# EasyEDA Pro project esp32_clock.eprj

# Schematic main
Create Date: 2022-02-27; Page Name: P1; Project Name: esp32_clock; Schematic Name: main; Update Date: 2022-08-12; Add into BOM: yes; Company: 深圳嘉立创科技发展有限公司; Convert to PCB: yes; Drawed: 嘉立创EDA; Page Size: A3; Part Number: JLCPCB-001; Reviewed: 嘉立创EDA; Version: V0.1
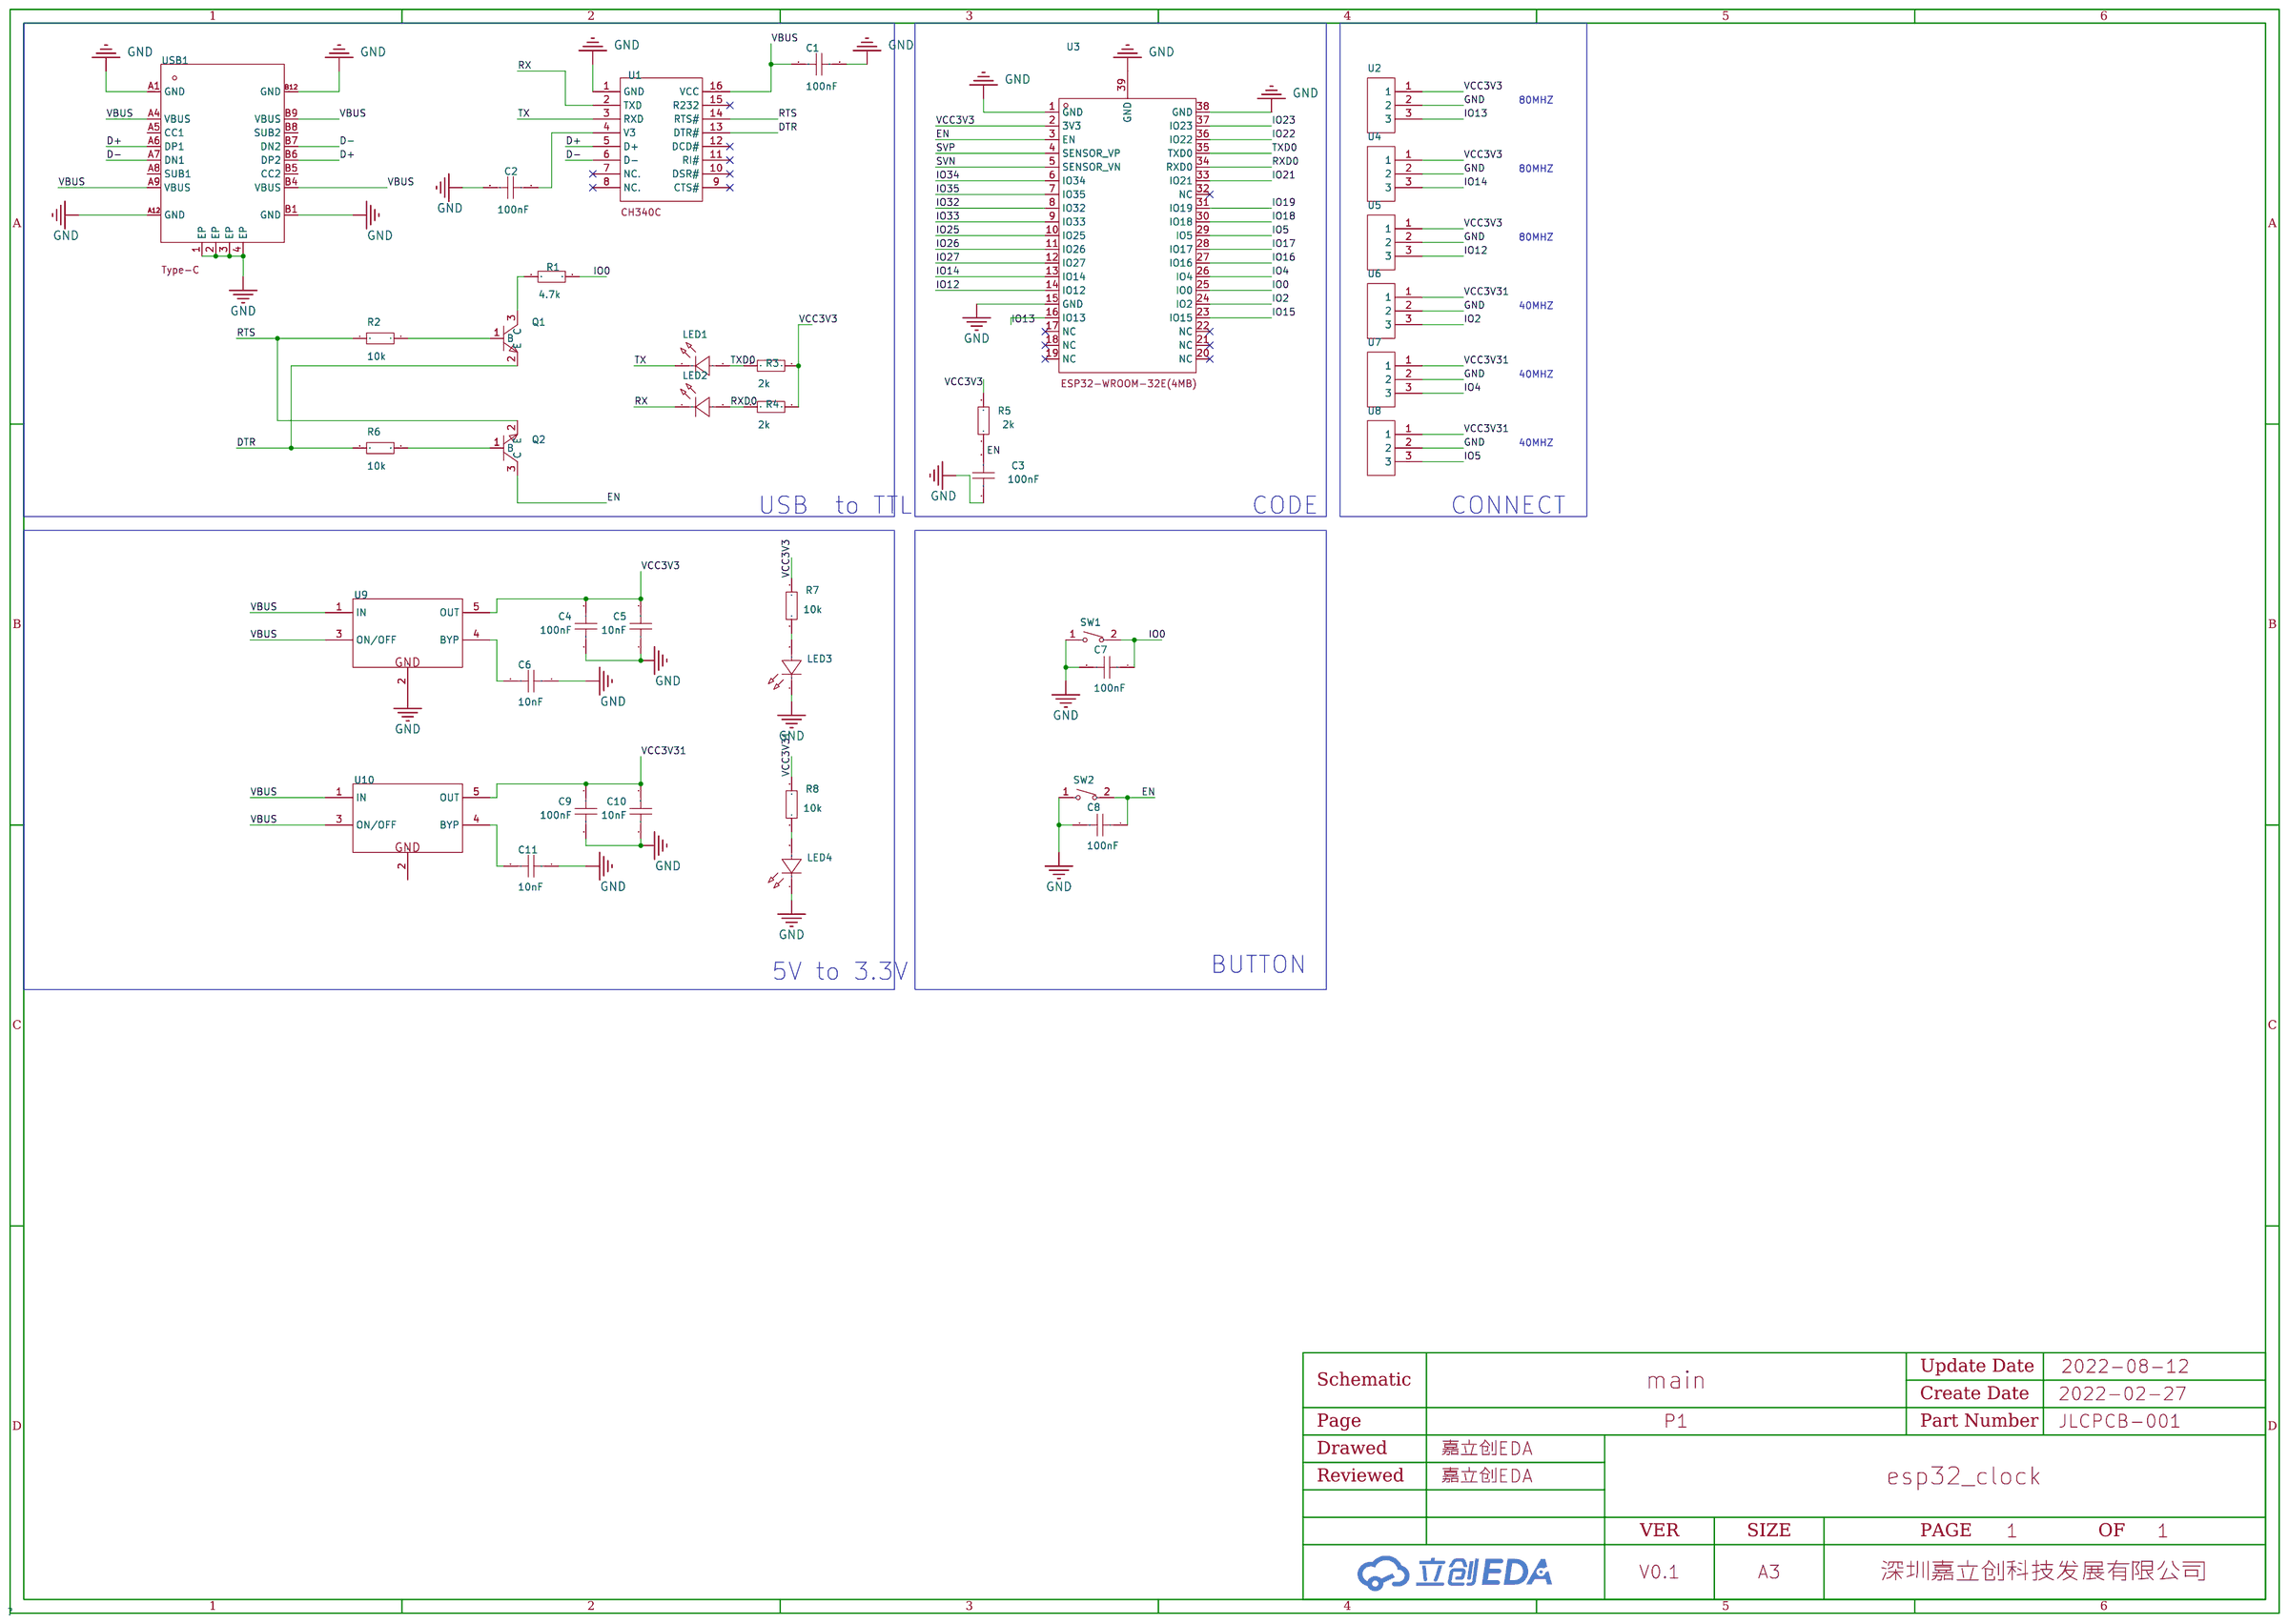
[diagram p0: schematic sheet]

## Parts
C1  100nF  [c0603]
C2  100nF  [c0603]
C3  100nF  [c0603]
C4  100nF  [c0603]
C5  10nF  [c0603]
C6  10nF  [c0603]
C7  100nF  [c0603]
C8  100nF  [c0603]
C9  100nF  [c0603]
C10  10nF  [c0603]
C11  10nF  [c0603]
LED1  11-21/BHC-AQ2S2/2T  [led-smd_l3.0-w1.5-rd]
LED2  11-21/BHC-AQ2S2/2T  [led-smd_l3.0-w1.5-rd]
LED3  11-21/BHC-AQ2S2/2T  [led-smd_l3.0-w1.5-rd]
LED4  11-21/BHC-AQ2S2/2T  [led-smd_l3.0-w1.5-rd]
Q1  -  [sot-23-3_l2.9-w1.3-p1.90-ls2.4-br]
Q2  -  [sot-23-3_l2.9-w1.3-p1.90-ls2.4-br]
R1  4.7k  [r0603]
R2  10k  [r0603]
R3  2k  [r0603]
R4  2k  [r0603]
R5  2k  [r0603]
R6  10k  [r0603]
R7  10k  [r0603]
R8  10k  [r0603]
SW1  -  [sw-smd_l6.0-w3.5-ls8.0-eh-1]
SW2  -  [sw-smd_l6.0-w3.5-ls8.0-eh-1]
U1  -  [sop-16_l10.0-w3.9-p1.27-ls6.0-bl]
U2  -  [conn-th_3p-p2.50_b3b-xh-a-lf-sn]
U3  U1  [wifi-smd_esp32-wroom-32e]
U4  -  [conn-th_3p-p2.50_b3b-xh-a-lf-sn]
U5  -  [conn-th_3p-p2.50_b3b-xh-a-lf-sn]
U6  -  [conn-th_3p-p2.50_b3b-xh-a-lf-sn]
U7  -  [conn-th_3p-p2.50_b3b-xh-a-lf-sn]
U8  -  [conn-th_3p-p2.50_b3b-xh-a-lf-sn]
U9  -  [sot-23-5_l3.0-w1.7-p0.95-ls2.8-br]
U10  -  [sot-23-5_l3.0-w1.7-p0.95-ls2.8-br]
USB1  -  [usb-c-smd_kh-type-c-16p]

## Library data of the parts
C1 C2 = 0603F104Z500CT: 容值:100nF;精度:-20%~+80%;额定电压:50V;材质(温度系数):Y5V;; LCSC Part Name: 100nF -20%~+80% 50V; Supplier Part: C83060; Manufacturer: Walsin(华新科); Supplier Footprint: 0603; Datasheet: https://atta.szlcsc.com/upload/public/pdf/source/20161119/1479540179445.pdf; Supplier: LCSC; Tolerance: -20%~+80%; Voltage Rated: 50V; Temperature Coefficient: Y5V; JLCPCB Part Class: Extended Part
C3 C7 C8 = CL10B104KC8NNNC: 容值:100nF;精度:±10%;额定电压:100V;材质(温度系数):X7R;; LCSC Part Name: 100nF ±10% 100V; Supplier Part: C15725; Manufacturer: SAMSUNG(三星); Supplier Footprint: 0603; Datasheet: https://atta.szlcsc.com/upload/public/pdf/source/20160103/1457707678663.pdf; Supplier: LCSC; Tolerance: ±10%; Voltage Rated: 100V; Temperature Coefficient: X7R
C4-C6 C9-C11 = CC0603KRX7R9BB104: 容值:100nF;精度:±10%;额定电压:50V;材质(温度系数):X7R;; LCSC Part Name: 100nF ±10% 50V; Supplier Part: C14663; Manufacturer: YAGEO(国巨); Supplier Footprint: 0603; Datasheet: https://atta.szlcsc.com/upload/public/pdf/source/20170116/1484561234239.pdf; Supplier: LCSC; Tolerance: ±10%; Voltage Rated: 50V; Temperature Coefficient: X7R
LED1-LED4 = 11-21/BHC-AQ2S2/2T: LCSC Part Name: Led; Supplier Part: C3014404; Manufacturer: EVERLIGHT(台湾亿光); Supplier Footprint: SMD,1.5x3mm; Datasheet: https://atta.szlcsc.com/upload/public/pdf/source/20220513/A56B845CA083C4E68F88D304929CC0C5.pdf; Supplier: LCSC
Q1 Q2 = S8050LT1 J3Y: LCSC Part Name: S8050; Supplier Part: C2926165; Manufacturer: FOSAN(富信); Manufacturer Part: S8050 J3Y; Supplier Footprint: SOT-23; Datasheet: https://atta.szlcsc.com/upload/public/pdf/source/20211203/FAF9E446EEEFA352739C30D23AB52B1B.pdf; Supplier: LCSC; JLCPCB Part Class: Extended Part
R1 R3-R5 = RC0805JR-072KL: 电阻类型:厚膜电阻;阻值:2k;精度:±5%;功率:125mW;温度系数:±100ppm/;最大工作电压:150V;工作温度范围:-55~+155;; LCSC Part Name: 2k ±5%; Supplier Part: C114748; Manufacturer: YAGEO(国巨); Supplier Footprint: 0805; Datasheet: https://atta.szlcsc.com/upload/public/pdf/source/20170704/1499151299173.pdf; Supplier: LCSC; Type: 厚膜电阻; Tolerance: ±5%; Power(Watts): 125mW; Temperature Coefficient: ±100ppm/; Overload Voltage (Max): 150V; Operating Temperature Range: -55~+155
R2 R6 = RS-03K1202FT: 阻值:12k;精度:±1%;功率:100mW;温度系数:±100ppm/;最大工作电压:50V;工作温度范围:-55~+155;; LCSC Part Name: 12k ±1%; Supplier Part: C136587; Manufacturer: FH(风华); Supplier Footprint: 0603; Datasheet: https://atta.szlcsc.com/upload/public/pdf/source/20181015/C136587_D0866CBA43F0FA75C317B7AA905D85E4.pdf; Supplier: LCSC; Tolerance: ±1%; Power(Watts): 100mW; Temperature Coefficient: ±100ppm/; Overload Voltage (Max): 50V; Operating Temperature Range: -55~+155; JLCPCB Part Class: Extended Part
R7 R8 = 0805W8J0103T5E: 电阻类型:厚膜电阻;阻值:10k;精度:±5%;功率:125mW;温度系数:±100ppm/;最大工作电压:150V;工作温度范围:-55~+155;; LCSC Part Name: 10k ±5%; Supplier Part: C25612; Manufacturer: UNI-ROYAL(厚声); Supplier Footprint: 0805; Datasheet: https://atta.szlcsc.com/upload/public/pdf/source/20200306/C422600_1E6D84923E4A46A82E41ADD87F860B5C.pdf; Supplier: LCSC; Type: 厚膜电阻; Tolerance: ±5%; Power(Watts): 125mW; Temperature Coefficient: ±100ppm/; Overload Voltage (Max): 150V; Operating Temperature Range: -55~+155
SW1 SW2 = TS-KG01T-ART50F: 触点电流:50mA;额定电压(DC):12V;绝缘电阻:100M;电路结构:单刀单掷;安装方式:立贴;按钮形状:矩形按钮;按钮/盖帽颜色:白色;作用力:250gf@±50gf;引脚样式:鸥翼型;开关长度:6mm;开关宽度:3.5mm;开关高度:5mm;带支架:否;; LCSC Part Name: 3*6*5.0正按贴片式按键开关 轻触开关; Supplier Part: C2874263; Manufacturer: HANBO(汉博); Supplier Footprint: SMD; Datasheet: https://atta.szlcsc.com/upload/public/pdf/source/20210827/D384EB065BE60C1A2BD0AE232663F41A.pdf; Supplier: LCSC; Contact Current: 50mA; Voltage Rating (DC): 12V; Insulation Resistance: 100M; Circuit: 单刀单掷; Mounting Style: 立贴; Actuator Style: 矩形按钮; Actuator/Cap Color: 白色; Operating Force: 250gf@±50gf; Pin Style: 鸥翼型; Switch Length: 6mm; Switch Width: 3.5mm; Switch Height: 5mm; Strike Gundam: 否
U1 = CH340C: 类型:Transceiver;协议类别:USB 2.0;驱动器/接收器数:-;数据速率:2Mbps;; Supplier Part: C84681; Manufacturer: WCH(南京沁恒); Supplier Footprint: SOP-16_150mil; Datasheet: https://atta.szlcsc.com/upload/public/pdf/source/20200819/C84681_ADBED554CE321879DBD6B1D06488689C.pdf; Supplier: LCSC; Type: Transceiver; Protocol: USB 2.0; Data Rate: 2Mbps; Supply Voltage: 3.3V, 5V; JLCPCB Part Class: Extended Part
U2 U4-U8 = B3B-XH-A(LF)(SN): 参考系列:XH;间距:2.5mm;插针结构:1x3P;排数:1;每排PIN数:3;行距:-;安装方式:-;触头材质:黄铜;; LCSC Part Name: XH插座 1*3P 间距2.5mm 直针; Supplier Part: C144394; Manufacturer: JST; Supplier Footprint: 插件,P=2.5mm; Datasheet: https://atta.szlcsc.com/upload/public/pdf/source/20180327/C144394_40EBA2F68C817AED706C9EFF4B81600D.pdf; Supplier: LCSC; Reference Series: XH; Pitch: 2.5mm; Pins Structure: 1x3P; Number of Rows: 1; Number of PINs Per Row: 3; Contact Material: 黄铜
U3 = ESP32-WROOM-32E(4MB): ESP32-WROOM-32E 集成 ESP32-D0WD-V3 芯片，具有?高的稳定性和安全性能。; LCSC Part Name: WIFI模块 PCB板载天线模组; Supplier Part: C701341; Manufacturer: ESPRESSIF(乐鑫); Supplier Footprint: SMD38,18x25.5x3.1; Datasheet: https://atta.szlcsc.com/upload/public/pdf/source/20200730/C701341_95E089979D39CD8D2471FDC7C7AF29A1.pdf; Supplier: LCSC; JLCPCB Part Class: Extended Part
U9 U10 = LP2992IM5-3.3/NOPB: 输出类型:固定;输出极性:正;输出通道数:1;最大输入电压:16V;输出电压:3.3V;压差:850mV@(250mA);输出电流:250mA;电源纹波抑制比(PRSS):45dB@(1kHz);; LCSC Part Name: Vin=16V Vout=3.3V 250mA 45dB@(1kHz); Supplier Part: C129353; Manufacturer: TI(德州仪器); Supplier Footprint: SOT-23-5; Datasheet: https://atta.szlcsc.com/upload/public/pdf/source/20170914/C129353_1505359994993968193.pdf; Supplier: LCSC; Output Type: 固定; Output Polarity: 正; Number of Outputs: 1; Maximum Input Voltage: 16V; Output Voltage: 3.3V; Dropout Voltage: 850mV@(250mA); Output Current: 250mA; Power Supply Rejection Ratio (PRSS): 45dB@(1kHz); JLCPCB Part Class: Extended Part
USB1 = KH-TYPE-C-16P: 连接器类型:Type-C;标准:-;公母:母座;触点数量:16;端口数量:1;安装方式:卧贴;额定电流 - 电源:3A;工作温度范围:-40~+85;; LCSC Part Name: Type-C 母座 卧贴; Supplier Part: C709357; Manufacturer: kinghelm(金航标); Supplier Footprint: SMD; Datasheet: https://atta.szlcsc.com/upload/public/pdf/source/20200911/C709357_AA8DCEB38BB20E3035A7ED7AE7667837.pdf; Supplier: LCSC; Connector Type: Type-C; Gender: 母座; Number of Contacts: 16; Number of Ports: 1; Mounting Style: 卧贴; Current Rating - Power (Max): 3A; Operating Temperature Range: -40~+85; JLCPCB Part Class: Extended Part

## Nets
GND: C1.2 C2.1 C3.1 C4.1 C5.1 C6.1 C7.2 C8.2 C9.1 C10.1 C11.1 LED3.1(K) LED4.1(K) SW1.1 SW2.1 U1.1(GND) U2.2 U3.1(GND) U3.15(GND) U3.38(GND) U3.39(GND) U4.2 U5.2 U6.2 U7.2 U8.2 U9.2(GND) U10.2(GND) USB1.1(EP) USB1.2(EP) USB1.3(EP) USB1.4(EP) USB1.A1(GND) USB1.A12(GND) USB1.B1(GND) USB1.B12(GND)
VBUS: C1.1 U1.16(VCC) U9.1(IN) U9.3(ON/OFF) U10.1(IN) U10.3(ON/OFF) USB1.A4(VBUS) USB1.A9(VBUS) USB1.B4(VBUS) USB1.B9(VBUS)
VCC3V3: C4.2 C5.2 R3.2 R4.2 R5.2 R7.2 U2.1 U3.2(3V3) U4.1 U5.1 U9.5(OUT)
VCC3V31: C9.2 C10.2 R8.2 U6.1 U7.1 U8.1 U10.5(OUT)
D+: U1.5(D+) USB1.A6(DP1) USB1.B6(DP2)
D-: U1.6(D-) USB1.A7(DN1) USB1.B7(DN2)
DTR: Q1.2(E) R6.1 U1.13(DTR#)
EN: C3.2 C8.1 Q2.3(C) R5.1 SW2.2 U3.3(EN)
IO0: C7.1 R1.2 SW1.2 U3.25(IO0)
IO2: U3.24(IO2) U6.3
IO4: U3.26(IO4) U7.3
IO5: U3.29(IO5) U8.3
IO12: U3.14(IO12) U5.3
IO13: U2.3 U3.16(IO13)
IO14: U3.13(IO14) U4.3
IO15: U3.23(IO15)
IO16: U3.27(IO16)
IO17: U3.28(IO17)
IO18: U3.30(IO18)
IO19: U3.31(IO19)
IO21: U3.33(IO21)
IO22: U3.36(IO22)
IO23: U3.37(IO23)
IO25: U3.10(IO25)
IO26: U3.11(IO26)
IO27: U3.12(IO27)
IO32: U3.8(IO32)
IO33: U3.9(IO33)
IO34: U3.6(IO34)
IO35: U3.7(IO35)
RTS: Q2.2(E) R2.1 U1.14(RTS#)
RX: LED2.1(K) U1.2(TXD)
RXD0: LED2.2(A) R4.1 U3.34(RXD0)
SVN: U3.5(SENSOR_VN)
SVP: U3.4(SENSOR_VP)
TX: LED1.1(K) U1.3(RXD)
TXD0: LED1.2(A) R3.1 U3.35(TXD0)
$1N2597: C2.2 U1.4(V3)
$1N6917: C6.2 U9.4(BYP)
$1N7926: Q2.1(B) R6.2
$1N7936: Q1.1(B) R2.2
$1N10272: LED3.2(A) R7.1
$1N11018: Q1.3(C) R1.1
$1N18113: C11.2 U10.4(BYP)
$1N18730: LED4.2(A) R8.1

Not connected (* = marked no-connect by the designer): U1 7(NC.)* 8(NC.)* 9(CTS#)* 10(DSR#)* 11(RI#)* 12(DCD#)* 15(R232)*; U3 17(NC)* 18(NC)* 19(NC)* 20(NC)* 21(NC)* 22(NC)* 32(NC)*; USB1 A5(CC1) A8(SUB1) B5(CC2) B8(SUB2)

## Notes on the sheet
- 80MHZ
- 80MHZ
- 80MHZ
- 40MHZ
- 40MHZ
- 40MHZ
- USB  to TTL
- CODE
- CONNECT
- 5V to 3.3V
- BUTTON

# Schematic light
Create Date: 2022-08-10; Page Name: P1; Project Name: esp32_clock; Schematic Name: light; Update Date: 2022-08-10
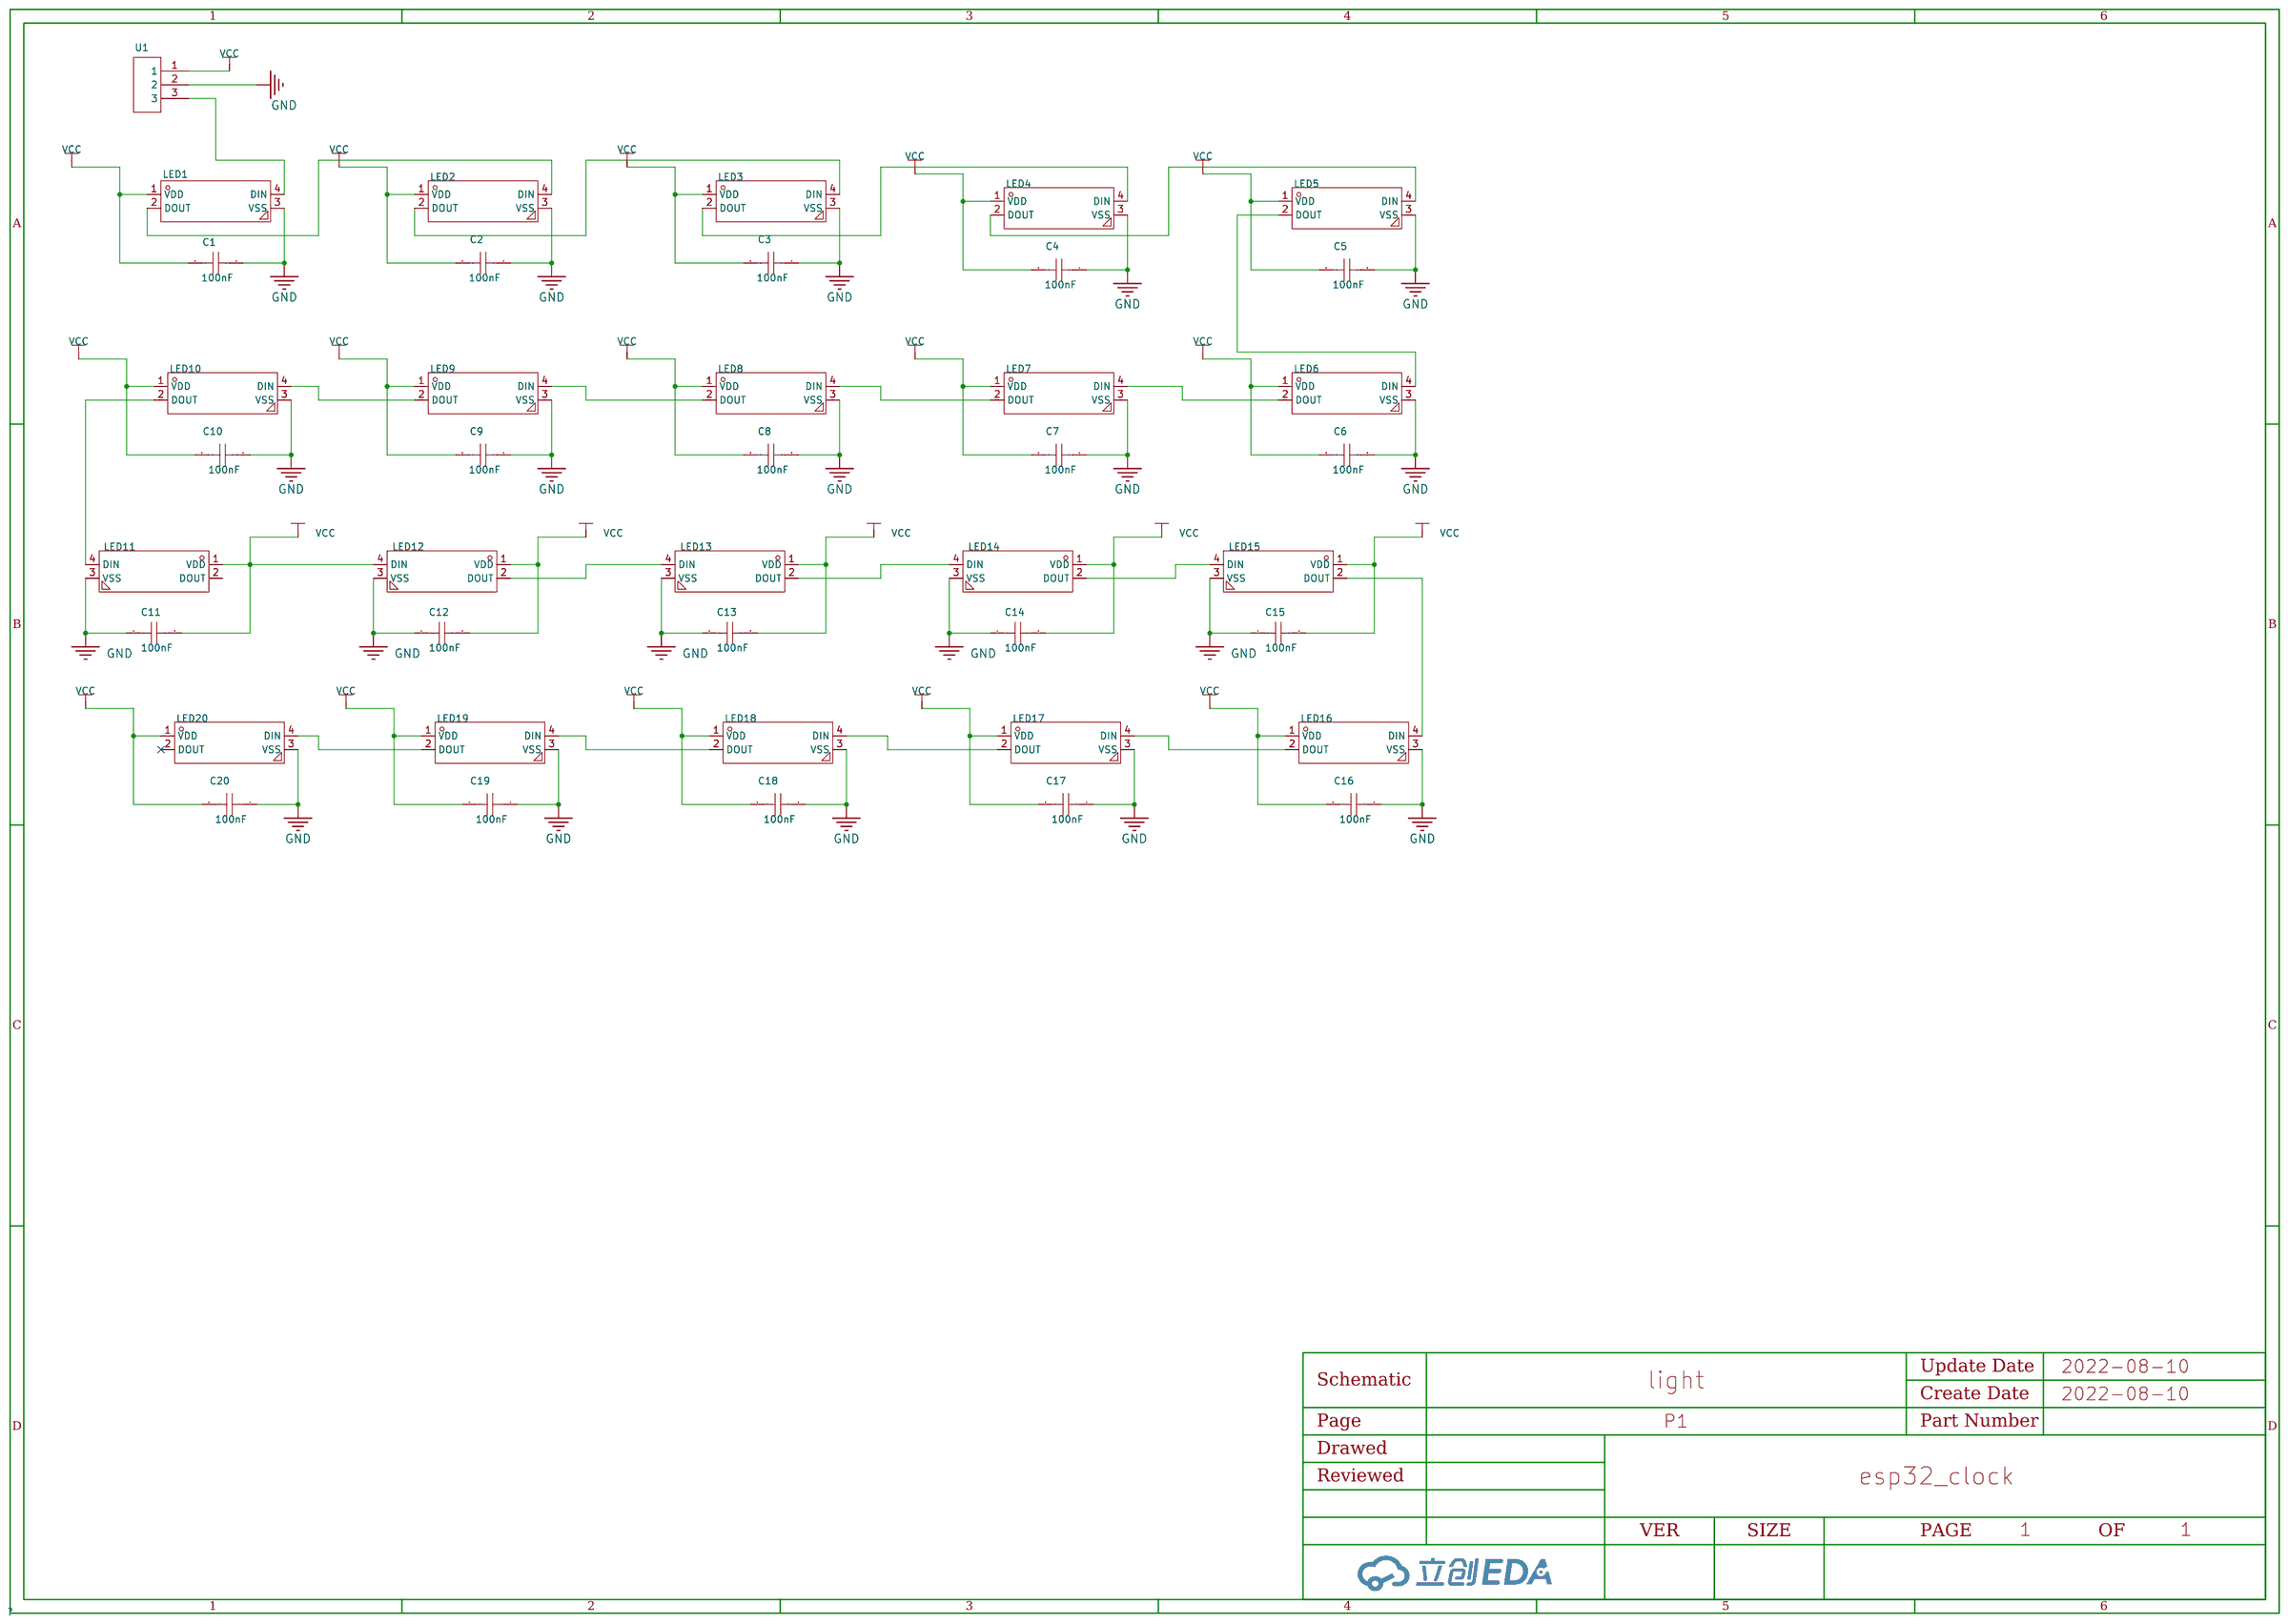
[diagram p1: schematic sheet]

## Parts
C1  100nF  [c0603]
C2  100nF  [c0603]
C3  100nF  [c0603]
C4  100nF  [c0603]
C5  100nF  [c0603]
C6  100nF  [c0603]
C7  100nF  [c0603]
C8  100nF  [c0603]
C9  100nF  [c0603]
C10  100nF  [c0603]
C11  100nF  [c0603]
C12  100nF  [c0603]
C13  100nF  [c0603]
C14  100nF  [c0603]
C15  100nF  [c0603]
C16  100nF  [c0603]
C17  100nF  [c0603]
C18  100nF  [c0603]
C19  100nF  [c0603]
C20  100nF  [c0603]
LED1  WS2812B-B  [led-smd_4p-l5.0-w5.0-tl_ws2812b-b]
LED2  WS2812B-B  [led-smd_4p-l5.0-w5.0-tl_ws2812b-b]
LED3  WS2812B-B  [led-smd_4p-l5.0-w5.0-tl_ws2812b-b]
LED4  WS2812B-B  [led-smd_4p-l5.0-w5.0-tl_ws2812b-b]
LED5  WS2812B-B  [led-smd_4p-l5.0-w5.0-tl_ws2812b-b]
LED6  WS2812B-B  [led-smd_4p-l5.0-w5.0-tl_ws2812b-b]
LED7  WS2812B-B  [led-smd_4p-l5.0-w5.0-tl_ws2812b-b]
LED8  WS2812B-B  [led-smd_4p-l5.0-w5.0-tl_ws2812b-b]
LED9  WS2812B-B  [led-smd_4p-l5.0-w5.0-tl_ws2812b-b]
LED10  WS2812B-B  [led-smd_4p-l5.0-w5.0-tl_ws2812b-b]
LED11  WS2812B-B  [led-smd_4p-l5.0-w5.0-tl_ws2812b-b]
LED12  WS2812B-B  [led-smd_4p-l5.0-w5.0-tl_ws2812b-b]
LED13  WS2812B-B  [led-smd_4p-l5.0-w5.0-tl_ws2812b-b]
LED14  WS2812B-B  [led-smd_4p-l5.0-w5.0-tl_ws2812b-b]
LED15  WS2812B-B  [led-smd_4p-l5.0-w5.0-tl_ws2812b-b]
LED16  WS2812B-B  [led-smd_4p-l5.0-w5.0-tl_ws2812b-b]
LED17  WS2812B-B  [led-smd_4p-l5.0-w5.0-tl_ws2812b-b]
LED18  WS2812B-B  [led-smd_4p-l5.0-w5.0-tl_ws2812b-b]
LED19  WS2812B-B  [led-smd_4p-l5.0-w5.0-tl_ws2812b-b]
LED20  WS2812B-B  [led-smd_4p-l5.0-w5.0-tl_ws2812b-b]
U1  -  [conn-th_3p-p2.50_b3b-xh-a-lf-sn]

## Library data of the parts
C1-C20 = TCC0603X7R104K500CT: 容值:100nF;精度:±10%;额定电压:50V;材质(温度系数):X7R;; LCSC Part Name: 100nF ±10% 50V; Supplier Part: C282519; Manufacturer: CCTC(三环); Supplier Footprint: 0603; Datasheet: https://atta.szlcsc.com/upload/public/pdf/source/20180917/C282519_8CE721FA29EE85BB321020B63D7877A0.pdf; Supplier: LCSC; Tolerance: ±10%; Voltage Rated: 50V; Temperature Coefficient: X7R
LED1-LED20 = WS2812B-B: 发光颜色:RGB三色;; LCSC Part Name: RGB三色 （注意防潮，请查阅规格书中对应具体内容）; Supplier Part: C114586; Manufacturer: worldsemi; Supplier Footprint: 5050(mm); Datasheet: https://atta.szlcsc.com/upload/public/pdf/source/20200615/C114586_26EB6813EC9F2A3F6C7FBB2AD75DE01F.pdf; Supplier: LCSC; Emitted Color: RGB三色
U1 = B3B-XH-A(LF)(SN): 参考系列:XH;间距:2.5mm;插针结构:1x3P;排数:1;每排PIN数:3;行距:-;安装方式:-;触头材质:黄铜;; LCSC Part Name: XH插座 1*3P 间距2.5mm 直针; Supplier Part: C144394; Manufacturer: JST; Supplier Footprint: 插件,P=2.5mm; Datasheet: https://atta.szlcsc.com/upload/public/pdf/source/20180327/C144394_40EBA2F68C817AED706C9EFF4B81600D.pdf; Supplier: LCSC; Reference Series: XH; Pitch: 2.5mm; Pins Structure: 1x3P; Number of Rows: 1; Number of PINs Per Row: 3; Contact Material: 黄铜

## Nets
GND: C1.1 C2.1 C3.1 C4.1 C5.1 C6.1 C7.1 C8.1 C9.1 C10.1 C11.1 C12.1 C13.1 C14.1 C15.1 C16.1 C17.1 C18.1 C19.1 C20.1 LED1.3(VSS) LED2.3(VSS) LED3.3(VSS) LED4.3(VSS) LED5.3(VSS) LED6.3(VSS) LED7.3(VSS) LED8.3(VSS) LED9.3(VSS) LED10.3(VSS) LED11.3(VSS) LED12.3(VSS) LED13.3(VSS) LED14.3(VSS) LED15.3(VSS) LED16.3(VSS) LED17.3(VSS) LED18.3(VSS) LED19.3(VSS) LED20.3(VSS) U1.2
VCC: C1.2 C2.2 C3.2 C4.2 C5.2 C6.2 C7.2 C8.2 C9.2 C10.2 C11.2 C12.2 C13.2 C14.2 C15.2 C16.2 C17.2 C18.2 C19.2 C20.2 LED1.1(VDD) LED2.1(VDD) LED3.1(VDD) LED4.1(VDD) LED5.1(VDD) LED6.1(VDD) LED7.1(VDD) LED8.1(VDD) LED9.1(VDD) LED10.1(VDD) LED11.1(VDD) LED12.1(VDD) LED12.4(DIN) LED13.1(VDD) LED14.1(VDD) LED15.1(VDD) LED16.1(VDD) LED17.1(VDD) LED18.1(VDD) LED19.1(VDD) LED20.1(VDD) U1.1
$1N4630: LED1.4(DIN) U1.3
$1N4980: LED1.2(DOUT) LED2.4(DIN)
$1N5294: LED2.2(DOUT) LED3.4(DIN)
$1N5614: LED3.2(DOUT) LED4.4(DIN)
$1N5940: LED4.2(DOUT) LED5.4(DIN)
$1N6272: LED5.2(DOUT) LED6.4(DIN)
$1N6610: LED6.2(DOUT) LED7.4(DIN)
$1N10070: LED10.2(DOUT) LED11.4(DIN)
$1N10076: LED12.2(DOUT) LED13.4(DIN)
$1N11666: LED15.2(DOUT) LED16.4(DIN)
$1N11672: LED17.2(DOUT) LED18.4(DIN)
$1N11675: LED18.2(DOUT) LED19.4(DIN)
$1N13346: LED7.2(DOUT) LED8.4(DIN)
$1N13393: LED8.2(DOUT) LED9.4(DIN)
$1N13814: LED9.2(DOUT) LED10.4(DIN)
$1N14639: LED13.2(DOUT) LED14.4(DIN)
$1N14851: LED14.2(DOUT) LED15.4(DIN)
$1N15317: LED16.2(DOUT) LED17.4(DIN)
$1N16131: LED19.2(DOUT) LED20.4(DIN)

Not connected (* = marked no-connect by the designer): LED11 2(DOUT); LED20 2(DOUT)*

# Board PCB2
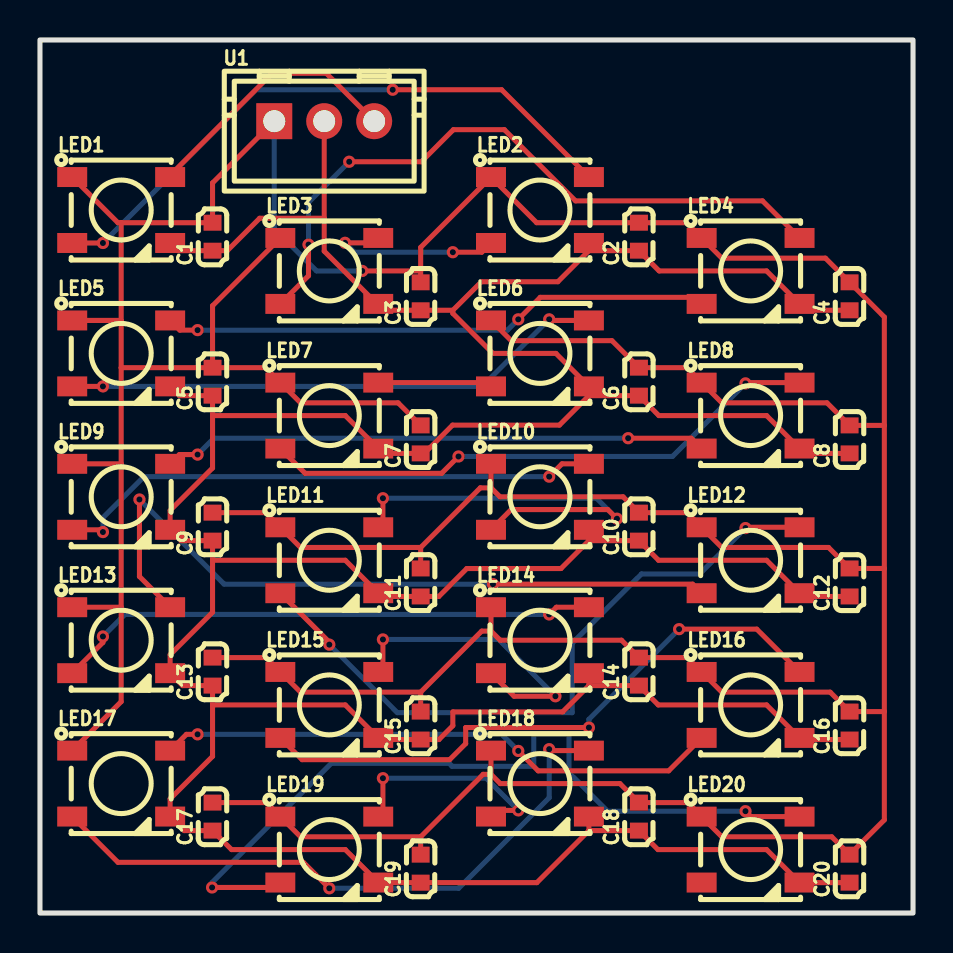
[diagram p2: board, top side]
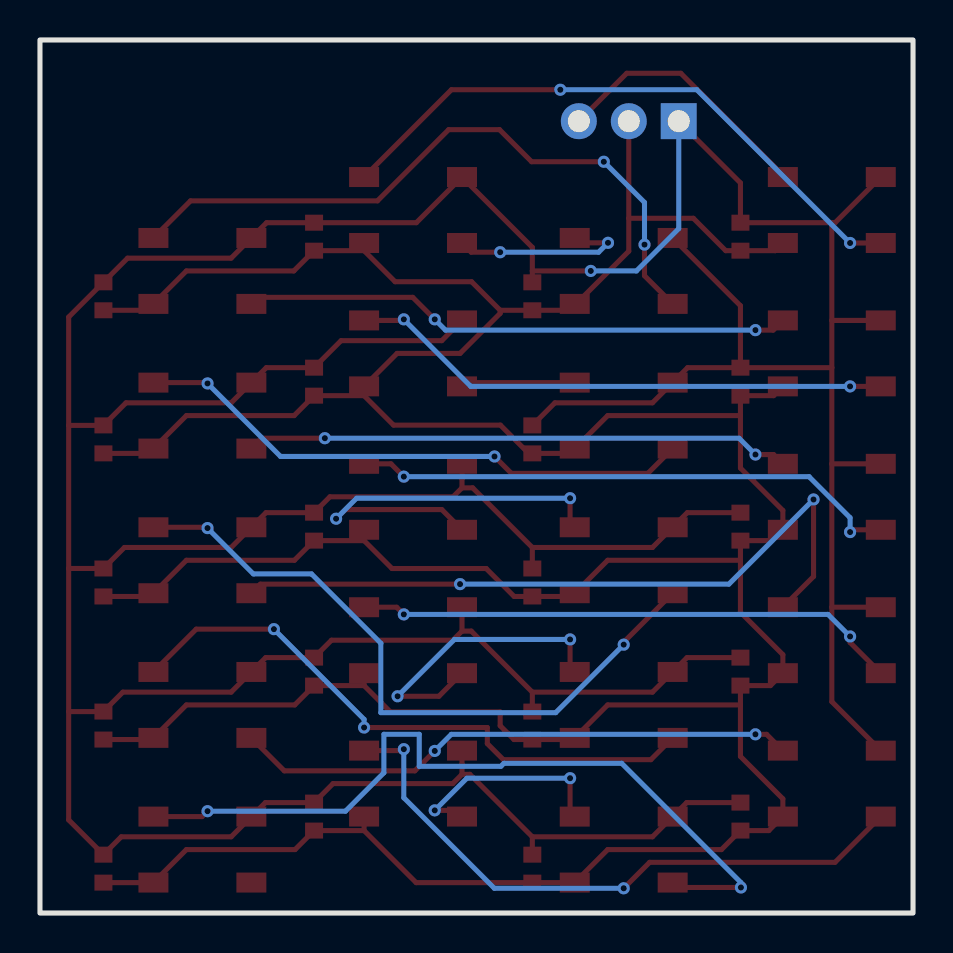
[diagram p3: board, bottom side, seen from below]

Outline 43.69 x 43.69 mm; copper layers: Top Layer, Bottom Layer. Coordinates in mm from the lower left corner of the outline.
Outline path: rectangle 0,43.69 43.69,0
Stack: Top Layer 0.035mm / 介电1 1.51mm FR4 er 4.5 / Bottom Layer 0.035mm

## Design rules (mm)
spacing safeClearance (default): track to track 0.152, other pairs 0.152 to 0.3
track width trackWidth (default): min 0.127, default 0.254, max 2.54
differential pair differentialPair (default): width min 0.127, default 0.254, max 2.54; gap min 0.152, default 0.152
via viaSize (default): diameter min 0.5, default 0.61, max 10; hole min 0.3, default 0.305, max 6

## Placement (name value [footprint] x y rotation side)
C1  100nF  [c0603]  8.64 33.84 90 top
C2  100nF  [c0603]  29.97 33.84 90 top
C3  100nF  [c0603]  19.05 30.86 90 top
C4  100nF  [c0603]  40.51 30.86 90 top
C5  100nF  [c0603]  8.64 26.59 90 top
C6  100nF  [c0603]  29.97 26.59 90 top
C7  100nF  [c0603]  19.05 23.7 90 top
C8  100nF  [c0603]  40.51 23.7 90 top
C9  100nF  [c0603]  8.64 19.33 90 top
C10  100nF  [c0603]  29.97 19.33 90 top
C11  100nF  [c0603]  19.05 16.54 90 top
C12  100nF  [c0603]  40.51 16.54 90 top
C13  100nF  [c0603]  8.64 12.08 90 top
C14  100nF  [c0603]  29.97 12.08 90 top
C15  100nF  [c0603]  19.05 9.38 90 top
C16  100nF  [c0603]  40.51 9.38 90 top
C17  100nF  [c0603]  8.64 4.83 90 top
C18  100nF  [c0603]  29.97 4.83 90 top
C19  100nF  [c0603]  19.05 2.22 90 top
C20  100nF  [c0603]  40.51 2.22 90 top
LED1  WS2812B-B  [led-smd_4p-l5.0-w5.0-tl_ws2812b-b]  4.06 35.18 0 top
LED2  WS2812B-B  [led-smd_4p-l5.0-w5.0-tl_ws2812b-b]  25.02 35.18 0 top
LED3  WS2812B-B  [led-smd_4p-l5.0-w5.0-tl_ws2812b-b]  14.48 32.13 0 top
LED4  WS2812B-B  [led-smd_4p-l5.0-w5.0-tl_ws2812b-b]  35.56 32.13 0 top
LED5  WS2812B-B  [led-smd_4p-l5.0-w5.0-tl_ws2812b-b]  4.06 28 0 top
LED6  WS2812B-B  [led-smd_4p-l5.0-w5.0-tl_ws2812b-b]  25.02 28 0 top
LED7  WS2812B-B  [led-smd_4p-l5.0-w5.0-tl_ws2812b-b]  14.48 24.89 0 top
LED8  WS2812B-B  [led-smd_4p-l5.0-w5.0-tl_ws2812b-b]  35.56 24.89 0 top
LED9  WS2812B-B  [led-smd_4p-l5.0-w5.0-tl_ws2812b-b]  4.06 20.83 0 top
LED10  WS2812B-B  [led-smd_4p-l5.0-w5.0-tl_ws2812b-b]  25.02 20.83 0 top
LED11  WS2812B-B  [led-smd_4p-l5.0-w5.0-tl_ws2812b-b]  14.48 17.65 0 top
LED12  WS2812B-B  [led-smd_4p-l5.0-w5.0-tl_ws2812b-b]  35.56 17.65 0 top
LED13  WS2812B-B  [led-smd_4p-l5.0-w5.0-tl_ws2812b-b]  4.06 13.65 0 top
LED14  WS2812B-B  [led-smd_4p-l5.0-w5.0-tl_ws2812b-b]  25.02 13.65 0 top
LED15  WS2812B-B  [led-smd_4p-l5.0-w5.0-tl_ws2812b-b]  14.48 10.41 0 top
LED16  WS2812B-B  [led-smd_4p-l5.0-w5.0-tl_ws2812b-b]  35.56 10.41 0 top
LED17  WS2812B-B  [led-smd_4p-l5.0-w5.0-tl_ws2812b-b]  4.06 6.48 0 top
LED18  WS2812B-B  [led-smd_4p-l5.0-w5.0-tl_ws2812b-b]  25.02 6.48 0 top
LED19  WS2812B-B  [led-smd_4p-l5.0-w5.0-tl_ws2812b-b]  14.48 3.17 0 top
LED20  WS2812B-B  [led-smd_4p-l5.0-w5.0-tl_ws2812b-b]  35.56 3.17 0 top
U1  -  [conn-th_3p-p2.50_b3b-xh-a-lf-sn]  14.22 39.62 0 top

## Footprints (pads in the part's own frame, mm; a bottom-side part is the same pattern mirrored in y, then rotated)
c0603
  rect 0.8x0.9 smd: 1(-0.7,0) 2(0.7,0)
conn-th_3p-p2.50_b3b-xh-a-lf-sn
  rect 1.8x1.8 hole 1.1: 1(-2.5,0)
  round 1.8 hole 1.1: 2(0,0) 3(2.5,0)
led-smd_4p-l5.0-w5.0-tl_ws2812b-b
  rect 1.5x1 smd: 1(-2.45,1.65) 2(-2.45,-1.65) 3(2.45,-1.65) 4(2.45,1.65)

## Nets
As in the schematic, except:
VCC: C1.2 C2.2 C3.2 C4.2 C5.2 C6.2 C7.2 C8.2 C9.2 C10.2 C11.2 C12.2 C13.2 C14.2 C15.2 C16.2 C17.2 C18.2 C19.2 C20.2 LED1.1 LED2.1 LED3.1 LED4.1 LED5.1 LED6.1 LED7.1 LED8.1 LED9.1 LED10.1 LED11.1 LED12.1 LED13.1 LED14.1 LED15.1 LED16.1 LED17.1 LED18.1 LED19.1 LED20.1 U1.1
$1N16455: LED11.2 LED12.4

Pads without a net: LED20 2

## Via types
v1: diameter 0.61, hole 0.305, Top Layer to Bottom Layer, 37 vias

## Routing (per net, layer and track width the routed paths; a pad name or vN(x,y) marks a point on that pad's centre or on a via; arc(x,y) is an arc through that point)
GND: length 228.6
  Top Layer w0.254: 8.64,17.65 8.64,15.05 6.51,12.93 LED13.3 7.14,11.38 C13.1 8.64,10.41 ; 8.64,17.65 15.28,17.65 LED11.3 17.09,15.84 C11.1 19.96,15.84 21.36,17.24 26.07,17.24 27.47,18.63 ; 8.64,17.65 C9.1 7.06,18.63 LED9.3 6.51,20.15 8.64,22.27 8.64,24.89 ; 27.47,4.13 24.86,1.52 C19.1 16.93,1.52 LED19.3 15.28,3.17 9.59,3.17 C17.1 7.22,4.13 LED17.3 6.51,5.72 8.64,7.84 8.64,10.41 ; 27.47,4.13 C18.1 30.92,3.17 36.36,3.17 LED20.3 38.01,1.52 C20.1 ; 27.47,4.13 LED18.3 ; 27.47,33.14 25.92,31.59 22.09,31.59 20.66,30.16 ; 27.47,33.14 C2.1 30.99,32.13 36.36,32.13 LED4.3 38.33,30.16 C4.1 ; 27.47,33.14 LED2.3 ; 27.47,18.63 C10.1 30.95,17.65 36.36,17.65 LED12.3 38.17,15.84 C12.1 ; 27.47,18.63 LED10.3 ; 20.66,30.16 20.66,30.01 22.66,28 25.82,28 LED6.3 27.47,25.89 ; 20.66,30.16 C3.1 17.25,30.16 LED3.3 16.86,30.48 14.22,33.12 14.22,34.77 ; C8.1 38.25,23 36.36,24.89 30.97,24.89 C6.1 27.47,25.89 ; 27.47,25.89 26,24.42 20.65,24.42 19.23,23 C7.1 17.17,23 15.28,24.89 8.64,24.89 ; 27.47,11.38 26.15,10.06 20.66,10.06 20.66,9.37 19.97,8.68 C15.1 17.01,8.68 LED15.3 15.28,10.41 8.64,10.41 ; 27.47,11.38 LED14.3 ; 27.47,11.38 C14.1 30.94,10.41 36.36,10.41 LED16.3 38.09,8.68 C16.1 ; 14.22,34.77 10.99,34.77 9.37,33.14 C1.1 6.9,33.14 LED1.3 ; 14.22,34.77 U1.2 ; LED5.3 6.98,25.89 C5.1 8.64,24.89
VCC: length 282.1
  Top Layer w0.254: 4.06,22.48 4.06,15.3 ; 4.06,22.48 4.06,27.29 ; 4.06,22.48 LED9.1 ; 4.06,15.3 LED13.1 ; 4.06,15.3 4.06,10.58 LED17.1 ; 4.06,34.54 C1.2 8.64,36.54 U1.1 ; 4.06,34.54 3.9,34.54 LED1.1 ; 4.06,34.54 4.06,29.65 ; 22.57,21.28 23.02,20.83 29.18,20.83 C10.2 32.38,20.03 LED12.1 34.12,18.29 39.46,18.29 C12.2 42.25,17.24 ; 22.57,21.28 22.03,21.28 19.05,18.29 ; 22.57,21.28 22.57,22.48 ; 19.05,11.05 C15.2 ; 19.05,11.05 22.11,14.11 22.57,14.11 ; 19.05,11.05 13.04,11.05 11.31,12.78 C13.2 ; 4.06,27.29 C5.2 ; 4.06,27.29 4.06,29.65 ; C17.2 11.33,5.53 LED19.1 13.04,3.81 19.05,3.81 ; C5.2 8.64,30.39 LED3.1 ; C5.2 11.28,27.29 LED7.1 13.04,25.53 17.92,25.53 C7.2 ; 22.57,29.65 23.58,28.64 28.62,28.64 C6.2 32.36,27.29 LED8.1 34.12,25.53 39.38,25.53 C8.2 42.25,24.4 ; 42.25,10.08 C16.2 39.54,11.05 34.12,11.05 32.39,12.78 C14.2 29.1,13.65 23.03,13.65 22.57,14.11 ; 42.25,10.08 42.25,4.66 C20.2 39.62,3.81 34.12,3.81 LED20.1 32.41,5.53 C18.2 29.02,6.48 23.03,6.48 22.57,6.94 ; 42.25,10.08 42.25,17.24 ; 42.25,24.4 42.25,17.24 ; 42.25,24.4 42.25,29.82 C4.2 39.3,32.77 34.12,32.77 LED4.1 32.35,34.54 C2.2 24.85,34.54 22.57,36.83 19.05,33.31 19.05,32.13 ; 4.06,29.65 LED5.1 ; 22.57,14.11 22.57,15.3 ; 19.05,3.81 22.18,6.94 22.57,6.94 ; 19.05,3.81 C19.2 ; 19.05,18.29 13.04,18.29 LED11.1 11.3,20.03 C9.2 ; 19.05,18.29 C11.2 ; 22.57,6.94 22.57,8.13 ; 19.05,32.13 C3.2 ; 19.05,32.13 v1(16.13,32.13)
  Bottom Layer w0.254: v1(16.13,32.13) 13.84,32.13 11.72,34.25 U1.1
$1N4630: length 13.4
  Top Layer w0.254: U1.3 14.33,42.02 11.62,42.02 6.51,36.92 LED1.4
$1N4980: length 30.8
  Top Layer w0.254: v1(3.15,33.53) LED1.2 ; v1(17.65,41.2) 23.1,41.2 LED2.4
  Bottom Layer w0.254: v1(3.15,33.53) 10.82,41.2 v1(17.65,41.2)
$1N5294: length 9.5
  Top Layer w0.254: v1(15.26,33.54) 16.68,33.54 LED3.4 ; v1(20.66,33.07) 22.11,33.07 22.57,33.53
  Bottom Layer w0.254: v1(15.26,33.54) 15.73,33.07 v1(20.66,33.07)
$1N5614: length 34
  Top Layer w0.254: v1(15.47,37.59) 19.08,37.59 20.69,39.2 23.24,39.2 26.8,35.64 36.15,35.64 LED4.4 ; LED3.2 13.44,31.89 v1(13.44,33.45)
  Bottom Layer w0.254: v1(15.47,37.59) 13.44,35.56 v1(13.44,33.45)
$1N5940: length 27.6
  Top Layer w0.254: v1(23.93,29.71) 25.03,30.81 32.78,30.81 LED4.2 ; v1(7.89,29.17) 7,29.17 LED5.4
  Bottom Layer w0.254: v1(7.89,29.17) 23.39,29.17 v1(23.93,29.71)
$1N6272: length 27.3
  Top Layer w0.254: v1(25.48,29.71) 25.54,29.65 LED6.4 ; LED5.2 v1(3.15,26.35)
  Bottom Layer w0.254: v1(3.15,26.35) 22.13,26.35 v1(25.48,29.71)
$1N6610: length 5.7
  Top Layer w0.254: 22.57,26.35 22.38,26.54 LED7.4
$1N10070: length 20.6
  Top Layer w0.254: LED11.4 17.16,19.54 v1(17.16,20.76) ; v1(28.87,19.73) 28.41,20.19 23.58,20.19 22.57,19.18
  Bottom Layer w0.254: v1(28.87,19.73) 27.85,20.76 v1(17.16,20.76)
$1N10076: length 36.1
  Top Layer w0.254: LED12.2 32.66,16.46 v1(22.67,16.46) ; v1(4.98,20.69) 4.98,16.84 LED13.4
  Bottom Layer w0.254: v1(22.67,16.46) 9.21,16.46 v1(4.98,20.69)
$1N11666: length 30.7
  Top Layer w0.254: v1(31.98,14.21) 35.87,14.21 38.01,12.06 ; LED15.2 13.12,7.67 20.5,7.67 21.3,8.48 21.3,9.28 v1(27.47,9.28)
  Bottom Layer w0.254: v1(31.98,14.21) 27.47,9.69 v1(27.47,9.28)
$1N11672: length 31.7
  Top Layer w0.254: v1(25.48,8.2) 25.55,8.13 LED18.4 ; LED17.2 3.9,2.54 13.18,2.54 v1(14.48,1.24)
  Bottom Layer w0.254: v1(25.48,8.2) 25.48,5.77 20.95,1.24 v1(14.48,1.24)
$1N11675: length 11
  Top Layer w0.254: LED19.4 17.16,5.06 v1(17.16,6.75) ; 22.57,4.83 22.88,5.14 v1(23.93,5.14)
  Bottom Layer w0.254: v1(17.16,6.75) 22.32,6.75 v1(23.93,5.14)
$1N13346: length 28.4
  Top Layer w0.254: 12.03,23.24 13.27,22 20.1,22 v1(20.94,22.85) ; LED8.4 35.34,26.54 v1(35.3,26.5)
  Bottom Layer w0.254: v1(35.3,26.5) 31.65,22.85 v1(20.94,22.85)
$1N13393: length 27.3
  Top Layer w0.254: v1(7.89,22.94) 6.98,22.94 LED9.4 ; 33.11,23.24 32.59,23.76 v1(29.43,23.76)
  Bottom Layer w0.254: v1(29.43,23.76) 8.71,23.76 v1(7.89,22.94)
$1N13814: length 27.7
  Top Layer w0.254: v1(3.15,19.06) 3.04,19.18 LED9.2 ; LED10.4 26.12,22.48 v1(25.48,21.84)
  Bottom Layer w0.254: v1(3.15,19.06) 3.15,19.78 5.21,21.84 v1(25.48,21.84)
$1N14639: length 27.4
  Top Layer w0.254: v1(3.15,13.84) 3.15,13.54 LED13.2 ; v1(25.48,14.94) 25.84,15.3 LED14.4
  Bottom Layer w0.254: v1(25.48,14.94) 4.25,14.94 v1(3.15,13.84)
$1N14851: length 15.2
  Top Layer w0.254: 16.93,12.06 17.16,12.3 v1(17.16,13.69) ; 22.57,12 23.72,10.85 v1(25.79,10.85)
  Bottom Layer w0.254: v1(25.79,10.85) 22.95,13.69 v1(17.16,13.69)
$1N15317: length 28.4
  Top Layer w0.254: LED16.2 31.46,7.12 24.93,7.12 v1(23.93,8.11) ; v1(7.89,8.94) 7.33,8.94 LED17.4
  Bottom Layer w0.254: v1(7.89,8.94) 23.1,8.94 v1(23.93,8.11)
$1N16131: length 40.1
  Top Layer w0.254: LED20.4 35.57,4.83 v1(35.3,5.1) ; LED19.2 11.78,1.28 v1(8.61,1.28)
  Bottom Layer w0.254: v1(35.3,5.1) 28.4,5.1 26.48,7.02 26.48,8.94 24.71,8.94 24.71,7.34 20.62,7.34 20.47,7.49 14.58,7.49 8.61,1.52 v1(8.61,1.28)
$1N16455: length 34.4
  Top Layer w0.254: LED12.4 35.34,19.3 v1(35.3,19.26) ; v1(14.48,13.43) 14.48,13.55 LED11.2
  Bottom Layer w0.254: v1(14.48,13.43) 17.88,10.03 26.63,10.03 26.63,13.5 30.1,16.97 33.01,16.97 v1(35.3,19.26)

# Board PCB4
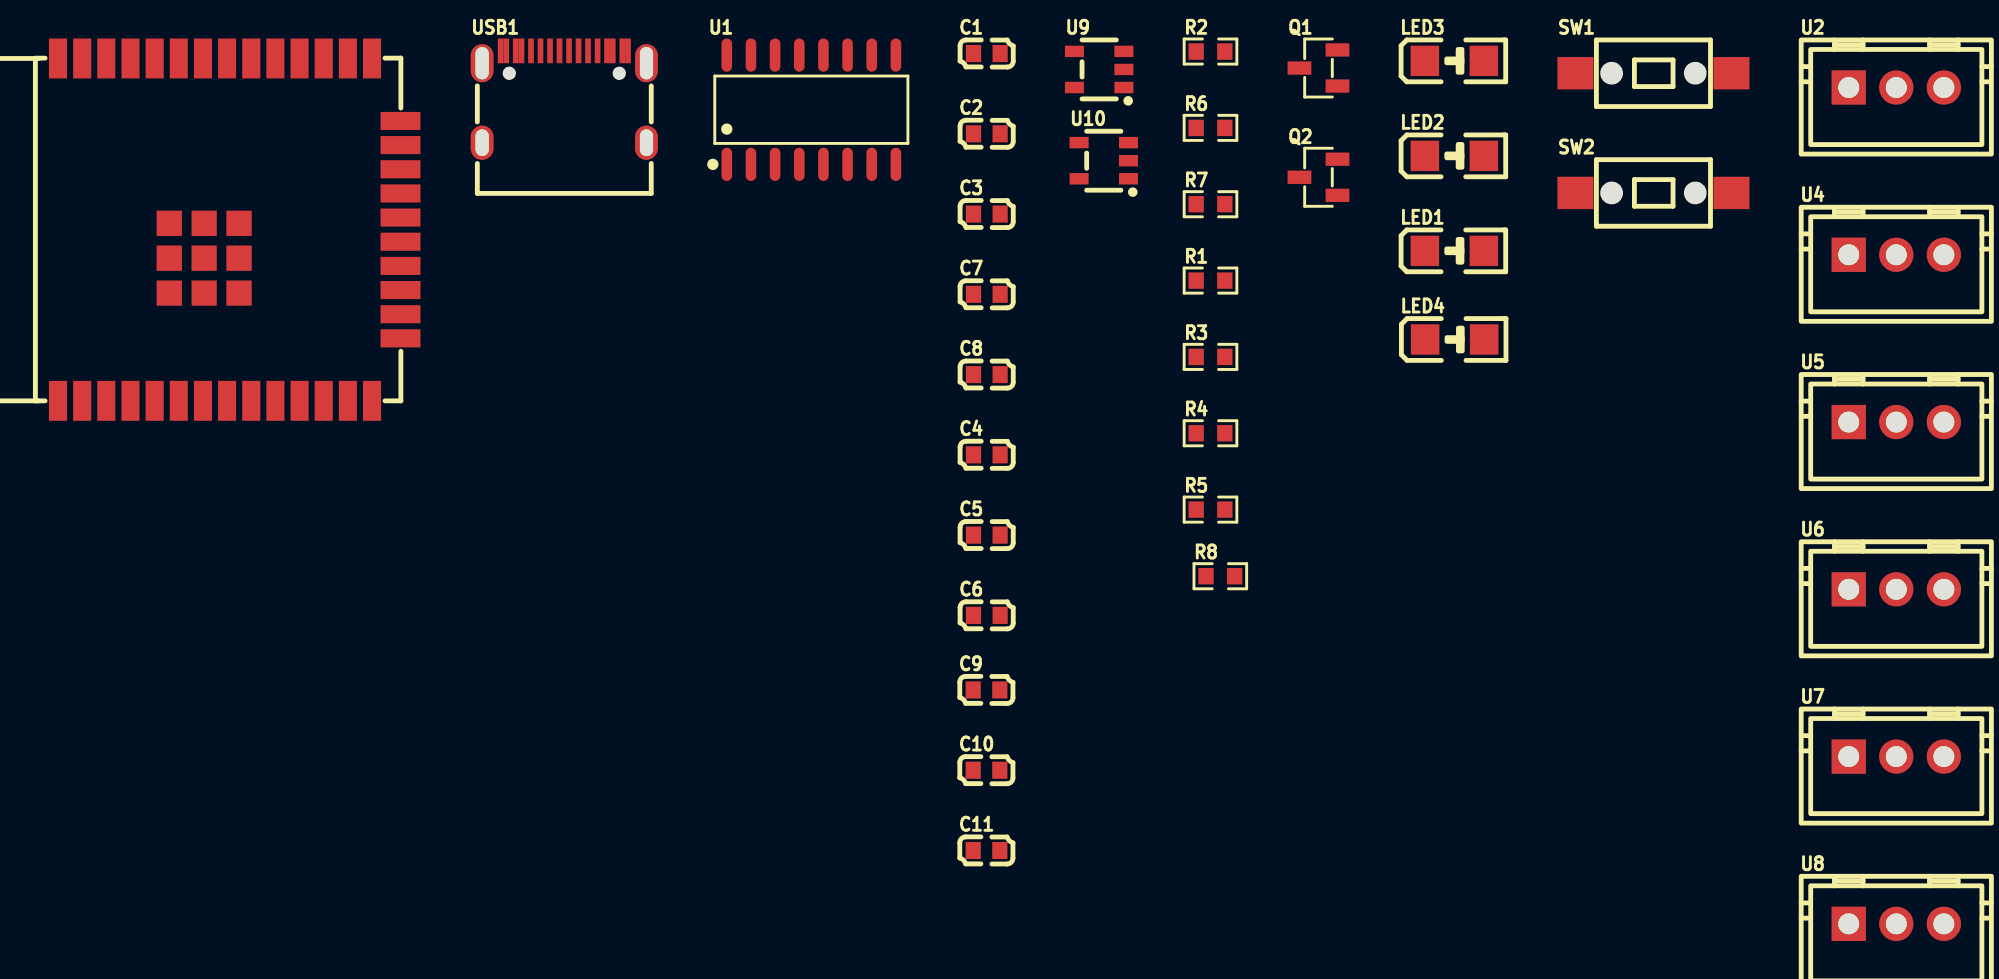
[diagram p4: board, top side]
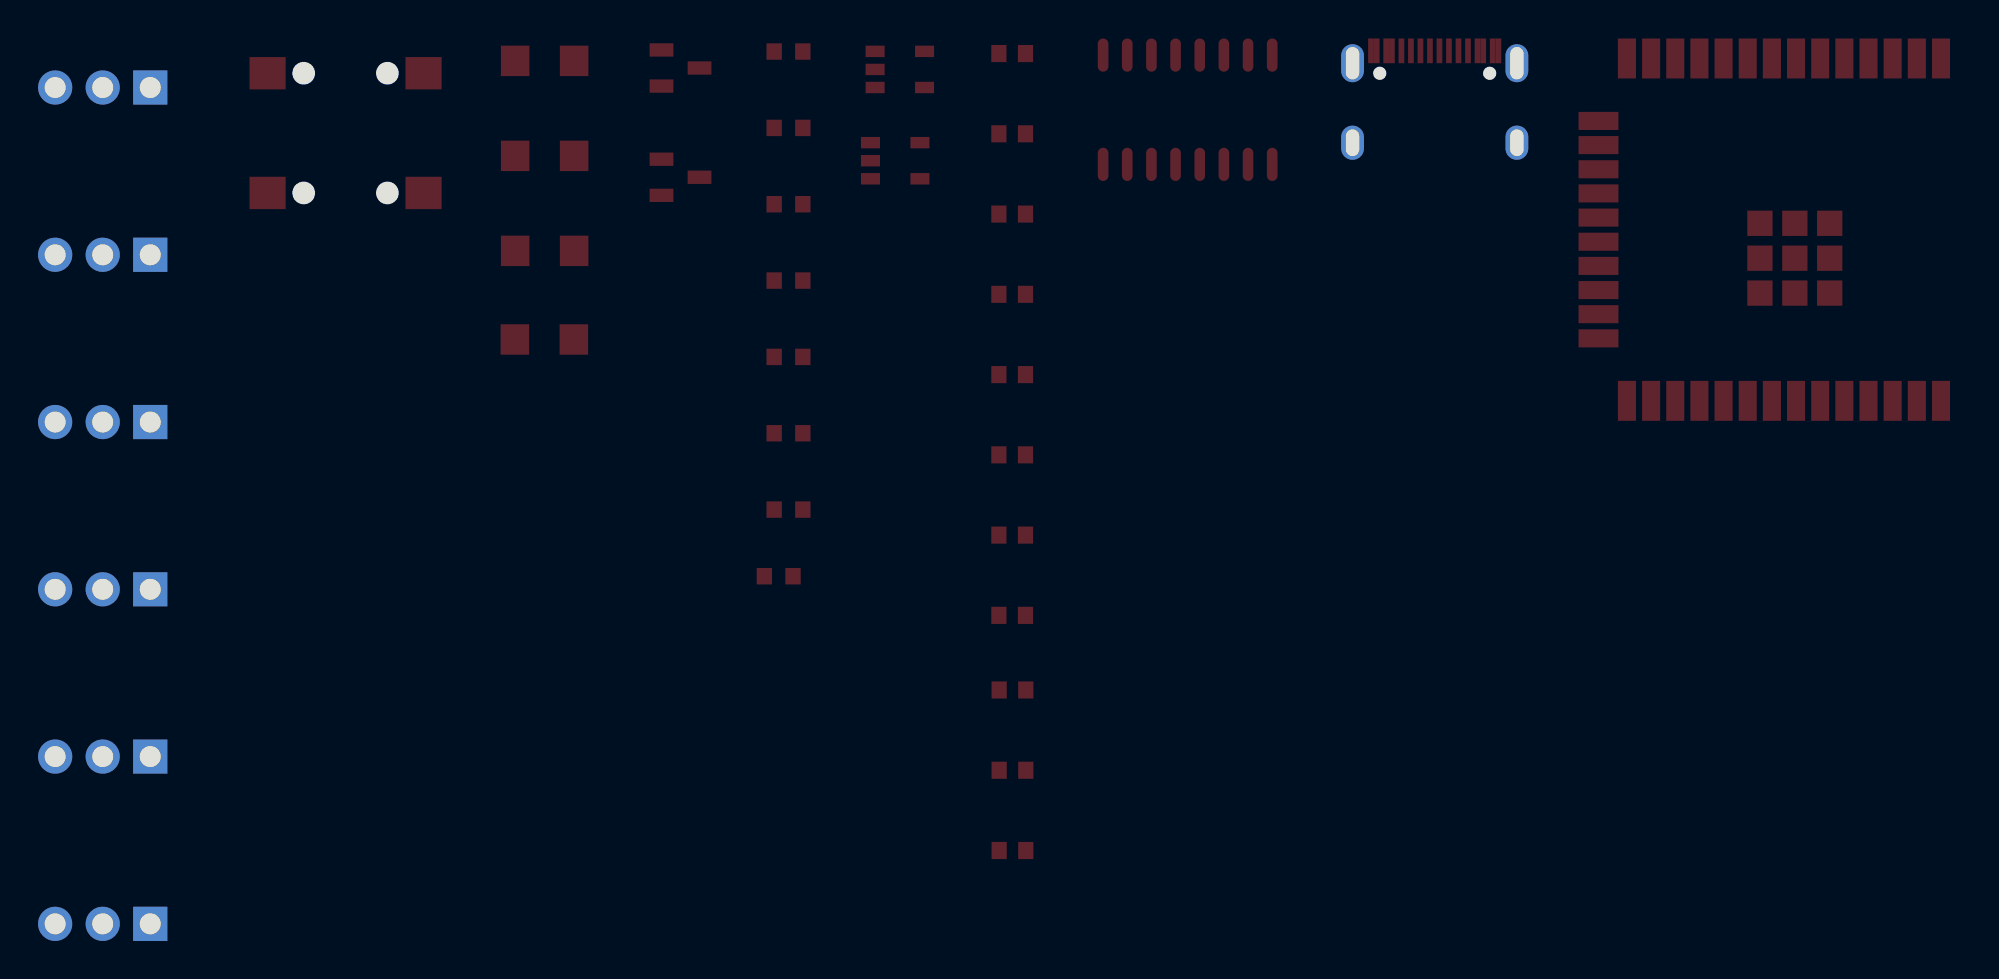
[diagram p5: board, bottom side, seen from below]

Outline 63.29 x 7.48 mm; copper layers: Top Layer, Bottom Layer. Coordinates in mm from the lower left corner of the outline.
Stack: Top Layer 0.035mm / 介电1 1.51mm FR4 er 4.5 / Bottom Layer 0.035mm

## Design rules (mm)
spacing safeClearance (default): track to track 0.152, other pairs 0.152 to 0.3
track width trackWidth (default): min 0.127, default 0.254, max 2.54
differential pair differentialPair (default): width min 0.127, default 0.254, max 2.54; gap min 0.152, default 0.152
via viaSize (default): diameter min 0.5, default 0.61, max 10; hole min 0.3, default 0.305, max 6

## Placement (name value [footprint] x y rotation side)
C1  100nF  [c0603]  25.45 7.92 0 top
C2  100nF  [c0603]  25.45 3.7 0 top
C3  100nF  [c0603]  25.45 -0.52 0 top
C4  100nF  [c0603]  25.45 -13.17 0 top
C5  10nF  [c0603]  25.45 -17.39 0 top
C6  10nF  [c0603]  25.45 -21.61 0 top
C7  100nF  [c0603]  25.45 -4.74 0 top
C8  100nF  [c0603]  25.45 -8.96 0 top
C9  100nF  [c0603]  25.44 -25.54 0 top
C10  10nF  [c0603]  25.44 -29.76 0 top
C11  10nF  [c0603]  25.44 -33.98 0 top
LED1  11-21/BHC-AQ2S2/2T  [led-smd_l3.0-w1.5-rd]  50.03 -2.45 0 top
LED2  11-21/BHC-AQ2S2/2T  [led-smd_l3.0-w1.5-rd]  50.03 2.54 0 top
LED3  11-21/BHC-AQ2S2/2T  [led-smd_l3.0-w1.5-rd]  50.03 7.54 0 top
LED4  11-21/BHC-AQ2S2/2T  [led-smd_l3.0-w1.5-rd]  50.05 -7.11 0 top
Q1  -  [sot-23-3_l2.9-w1.3-p1.90-ls2.4-br]  42.89 7.16 0 top
Q2  -  [sot-23-3_l2.9-w1.3-p1.90-ls2.4-br]  42.89 1.42 0 top
R1  4.7k  [r0603]  37.21 -4.01 0 top
R2  10k  [r0603]  37.21 8.03 0 top
R3  2k  [r0603]  37.21 -8.03 0 top
R4  2k  [r0603]  37.21 -12.04 0 top
R5  2k  [r0603]  37.21 -16.05 0 top
R6  10k  [r0603]  37.21 4.01 0 top
R7  10k  [r0603]  37.21 0 0 top
R8  10k  [r0603]  37.73 -19.56 0 top
SW1  -  [sw-smd_l6.0-w3.5-ls8.0-eh-1]  60.5 6.89 0 top
SW2  -  [sw-smd_l6.0-w3.5-ls8.0-eh-1]  60.5 0.59 0 top
U1  -  [sop-16_l10.0-w3.9-p1.27-ls6.0-bl]  16.23 4.97 0 top
U2  -  [conn-th_3p-p2.50_b3b-xh-a-lf-sn]  73.27 6.14 0 top
U3  U1  [wifi-smd_esp32-wroom-32e]  -14.38 -1.34 0 top
U4  -  [conn-th_3p-p2.50_b3b-xh-a-lf-sn]  73.27 -2.66 0 top
U5  -  [conn-th_3p-p2.50_b3b-xh-a-lf-sn]  73.27 -11.45 0 top
U6  -  [conn-th_3p-p2.50_b3b-xh-a-lf-sn]  73.27 -20.24 0 top
U7  -  [conn-th_3p-p2.50_b3b-xh-a-lf-sn]  73.27 -29.04 0 top
U8  -  [conn-th_3p-p2.50_b3b-xh-a-lf-sn]  73.27 -37.83 0 top
U9  -  [sot-23-5_l3.0-w1.7-p0.95-ls2.8-br]  31.36 7.09 0 top
U10  -  [sot-23-5_l3.0-w1.7-p0.95-ls2.8-br]  31.6 2.29 0 top
USB1  -  [usb-c-smd_kh-type-c-16p]  3.24 5.65 0 top

## Footprints (pads in the part's own frame, mm; a bottom-side part is the same pattern mirrored in y, then rotated)
c0603
  rect 0.8x0.9 smd: 1(-0.7,0) 2(0.7,0)
conn-th_3p-p2.50_b3b-xh-a-lf-sn
  rect 1.8x1.8 hole 1.1: 1(-2.5,0)
  round 1.8 hole 1.1: 2(0,0) 3(2.5,0)
led-smd_l3.0-w1.5-rd
  rect 1.5x1.6 smd: 1(-1.55,0) 2(1.55,0)
r0603
  rect 0.806x0.864 smd: 1(-0.753,0) 2(0.753,0)
sop-16_l10.0-w3.9-p1.27-ls6.0-bl
  oval 0.56x1.745 smd: 1(-4.445,-2.873) 2(-3.175,-2.873) 3(-1.905,-2.873) 4(-0.635,-2.873) 5(0.635,-2.873) 6(1.905,-2.873) 7(3.175,-2.873) 8(4.445,-2.873) 9(4.445,2.873) 10(3.175,2.873) 11(1.905,2.873) 12(0.635,2.873) 13(-0.635,2.873) 14(-1.905,2.873) 15(-3.175,2.873) 16(-4.445,2.873)
sot-23-3_l2.9-w1.3-p1.90-ls2.4-br
  rect 1.25x0.7 smd: 1(1,-0.95) 2(1,0.95) 3(-1,0)
sot-23-5_l3.0-w1.7-p0.95-ls2.8-br
  rect 1x0.6 smd: 1(1.3,-0.95) 2(1.3,0) 3(1.3,0.95) 4(-1.3,0.95) 5(-1.3,-0.95)
sw-smd_l6.0-w3.5-ls8.0-eh-1
  rect 1.9x1.7 smd: 1(-4.099,0) 2(4.099,0)
usb-c-smd_kh-type-c-16p
  oval 1.2x2 hole 0.7x1.7: 1(-4.32,1.765) 2(4.32,1.765)
  oval 1.2x1.8 hole 0.7x1.4: 3(-4.32,-2.415) 4(4.32,-2.415)
  rect 0.3x1.3 smd: A1(-3.35,2.415) A4(-2.55,2.415) A5(-1.25,2.415) A6(-0.25,2.415) A7(0.25,2.415) A8(1.25,2.415) A9(2.55,2.415) A12(3.35,2.415) B1(3.05,2.415) B4(2.25,2.415) B5(1.75,2.415) B6(0.75,2.415) B7(-0.75,2.415) B8(-1.75,2.415) B9(-2.25,2.415) B12(-3.05,2.415)
wifi-smd_esp32-wroom-32e
  rect 0.95x2.1 smd: 1(-9.002,-9) 2(-7.732,-9) 3(-6.463,-9) 4(-5.192,-9) 5(-3.922,-9) 6(-2.652,-9) 7(-1.383,-9) 8(-0.113,-9) 9(1.157,-9) 10(2.428,-9) 11(3.697,-9) 12(4.968,-9) 13(6.237,-9) 14(7.508,-9) 25(7.508,9) 26(6.237,9) 27(4.968,9) 28(3.697,9) 29(2.428,9) 30(1.157,9) 31(-0.113,9) 32(-1.383,9) 33(-2.652,9) 34(-3.922,9) 35(-5.192,9) 36(-6.463,9) 37(-7.732,9) 38(-9.002,9)
  rect 2.1x0.95 smd: 15(9.002,-5.715) 16(9.002,-4.445) 17(9.002,-3.175) 18(9.002,-1.905) 19(9.002,-0.635) 20(9.002,0.635) 21(9.002,1.905) 22(9.002,3.175) 23(9.002,4.445) 24(9.002,5.715)
  rect 1.33x1.33 smd: 39(-3.154,0.335) 39(-3.154,-1.5) 39(-3.154,-3.335) 39(-1.319,0.335) 39(-1.319,-1.5) 39(-1.319,-3.335) 39(0.516,0.335) 39(0.516,-1.5) 39(0.516,-3.335)

## Nets
As in the schematic.

Pads without a net: U1 7 8 9 10 11 12 15; U3 17 18 19 20 21 22 32; USB1 A5 A8 B5 B8
